# Altium project R100.230.030.000-00 ControlVR.PrjPcb (part 2 of 2)

## Sheet 08_Parallel_operation.SchDoc
size A4; Organization: OLTEST; Revision: 01; SheetNumber: 8; SheetTotal: 13; Название листа: Название листа; Разработчик: Бондарчук С.; Прибор: R100; АМАК.000000.000 Э3: R100.230.030.000-00; Дата: 16.04.2019; Формат: A4; workspacename: R100_Boards_v1; PageSetup: Record=PageOptions|CenterHorizontal=True|CenterVertical=True|PrintScale=0.97|XCorrection=1.00|YCorrection=1.00|PrintKind=0|BorderSize=5000000|LeftOffset=0|BottomOffset=0|Orientation=2|PaperLength=1000|PaperWidth=1000|Scale=100|PaperSource=7|PrintQuality=-3|MediaType=1|DitherType=10|PrintScaleMode=1|PaperKind=A4|PaperIndex=9
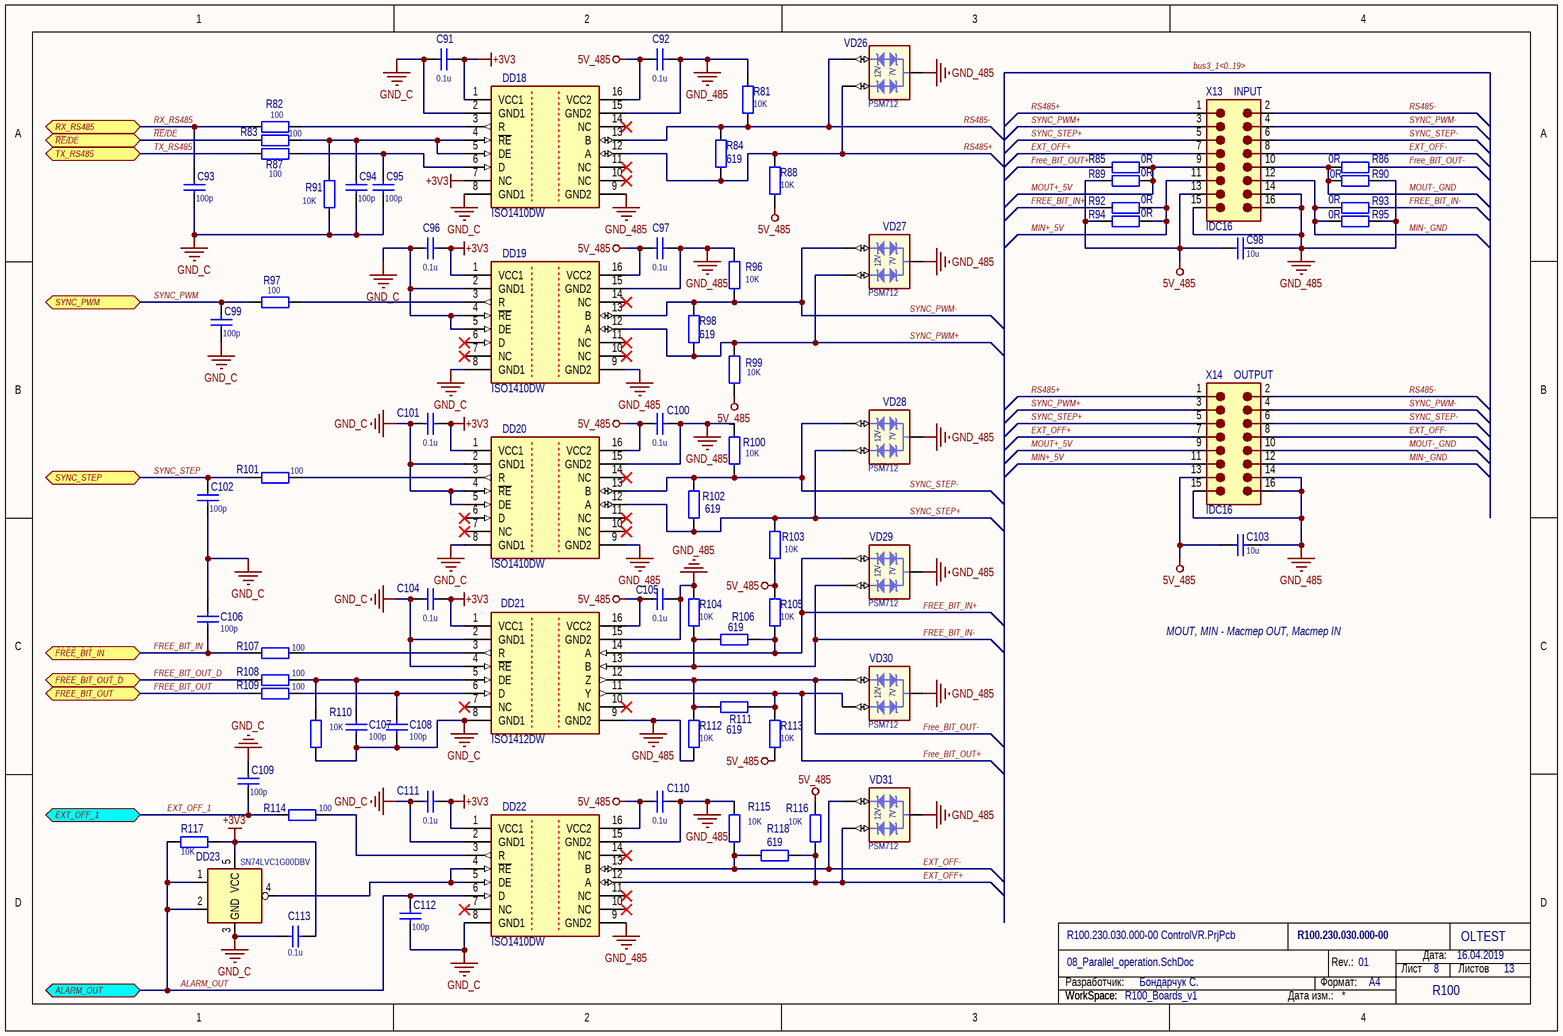
[diagram p7: 08_Parallel_operation.SchDoc]

### Parts
C91  0.1u  [SMD_C_0603]
C92  0.1u  [SMD_C_0603]
C93  100p  [SMD_C_0603]
C94  100p  [SMD_C_0603]
C95  100p  [SMD_C_0603]
C96  0.1u  [SMD_C_0603]
C97  0.1u  [SMD_C_0603]
C98  10u  [SMD_C_1206]
C99  100p  [SMD_C_0603]
C100  0.1u  [SMD_C_0603]
C101  0.1u  [SMD_C_0603]
C102  100p  [SMD_C_0603]
C103  10u  [SMD_C_1206]
C104  0.1u  [SMD_C_0603]
C105  0.1u  [SMD_C_0603]
C106  100p  [SMD_C_0603]
C107  100p  [SMD_C_0603]
C108  100p  [SMD_C_0603]
C109  100p  [SMD_C_0603]
C110  0.1u  [SMD_C_0603]
C111  0.1u  [SMD_C_0603]
C112  100p  [SMD_C_0603]
C113  0.1u  [SMD_C_0603]
DD18  ISO1410DW  [SOIC127P1030X265-16M]
DD19  ISO1410DW  [SOIC127P1030X265-16M]
DD20  ISO1410DW  [SOIC127P1030X265-16M]
DD21  ISO1412DW  [SOIC127P1030X265-16M]
DD22  ISO1410DW  [SOIC127P1030X265-16M]
DD23  SN74LVC1G00DBV  [SOT-23(DBV)]
R81  10K  [SMD_R_0603]
R82  100  [SMD_R_0603]
R83  100  [SMD_R_0603]
R84  619  [SMD_R_0603]
R85  0R  [SMD_R_0603]
R86  0R  [SMD_R_0603]
R87  100  [SMD_R_0603]
R88  10K  [SMD_R_0603]
R89  0R  [SMD_R_0603]
R90  0R  [SMD_R_0603]
R91  10K  [SMD_R_0603]
R92  0R  [SMD_R_0603]
R93  0R  [SMD_R_0603]
R94  0R  [SMD_R_0603]
R95  0R  [SMD_R_0603]
R96  10K  [SMD_R_0603]
R97  100  [SMD_R_0603]
R98  619  [SMD_R_0603]
R99  10K  [SMD_R_0603]
R100  10K  [SMD_R_0603]
R101  100  [SMD_R_0603]
R102  619  [SMD_R_0603]
R103  10K  [SMD_R_0603]
R104  10K  [SMD_R_0603]
R105  10K  [SMD_R_0603]
R106  619  [SMD_R_0603]
R107  100  [SMD_R_0603]
R108  100  [SMD_R_0603]
R109  100  [SMD_R_0603]
R110  10K  [SMD_R_0603]
R111  619  [SMD_R_0603]
R112  10K  [SMD_R_0603]
R113  10K  [SMD_R_0603]
R114  100  [SMD_R_0603]
R115  10K  [SMD_R_0603]
R116  10K  [SMD_R_0603]
R117  10K  [SMD_R_0603]
R118  619  [SMD_R_0603]
VD26  PSM712  [SOT23-3]
VD27  PSM712  [SOT23-3]
VD28  PSM712  [SOT23-3]
VD29  PSM712  [SOT23-3]
VD30  PSM712  [SOT23-3]
VD31  PSM712  [SOT23-3]
X13  IDC16  [918516x324]
X14  IDC16  [918516x324]

### Ports
ALARM_OUT (bidir), EXT_OFF_1 (bidir), FREE_BIT_IN (bidir), FREE_BIT_OUT (bidir), FREE_BIT_OUT_D (bidir), RX_RS485, SYNC_PWM (bidir), SYNC_STEP (bidir), TX_RS485 (bidir), ~{RE}/DE (bidir)

### Nets
5V_485: C92.2 C97.2 C98.2 C100.2 C103.2 C105.2 C110.2 DD18.16(VCC2) DD19.16(VCC2) DD20.16(VCC2) DD21.16(VCC2) DD22.16(VCC2) R88.1 R89.1 R94.1 R99.1 R103.1 R105.2 R113.1 R116.2 X13.13 X14.13
+3V3: C91.1 C96.2 C101.2 C104.2 C111.2 C113.1 DD18.1(VCC1) DD18.7(NC) DD19.1(VCC1) DD20.1(VCC1) DD21.1(VCC1) DD22.1(VCC1) DD23.5(VCC) R117.1
GND_485: C92.1 C97.1 C98.1 C100.1 C103.1 C105.1 C110.1 DD18.9(GND2) DD18.15(GND2) DD19.9(GND2) DD19.15(GND2) DD20.9(GND2) DD20.15(GND2) DD21.9(GND2) DD21.15(GND2) DD22.9(GND2) DD22.15(GND2) R81.1 R90.2 R95.2 R96.2 R100.2 R104.2 R112.1 R115.2 VD26.3(GND) VD27.3(GND) VD28.3(GND) VD29.3(GND) VD30.3(GND) VD31.3(GND) X13.14 X13.15 X13.16 X14.14 X14.15 X14.16
GND_C: C91.2 C93.1 C94.1 C95.1 C96.1 C99.1 C101.1 C102.1 C104.1 C106.1 C107.2 C108.2 C109.2 C111.1 C112.1 C113.2 DD18.2(GND1) DD18.8(GND1) DD19.2(GND1) DD19.4(~{RE}) DD19.5(DE) DD19.8(GND1) DD20.2(GND1) DD20.4(~{RE}) DD20.5(DE) DD20.8(GND1) DD21.2(GND1) DD21.4(~{RE}) DD21.8(GND1) DD22.2(GND1) DD22.8(GND1) DD23.3(GND) R91.1 R110.1
~{RE}/DE: R83.1 ; port ~{RE}/DE
ALARM_OUT: C112.2 DD22.6(D) DD23.1 DD23.2 R117.2 ; port ALARM_OUT
EXT_OFF+: DD22.12(A) R116.1 R118.1 VD31.2(I/O2) X13.7 X14.7
EXT_OFF-: DD22.13(B) R115.1 R118.2 VD31.1(I/O1) X13.8 X14.8
EXT_OFF_1: C109.1 R114.1 ; port EXT_OFF_1
FREE_BIT_IN: C106.2 R107.1 ; port FREE_BIT_IN
FREE_BIT_IN+: DD21.14(A) R92.1 R105.1 R106.1 VD29.1(I/O1)
FREE_BIT_IN-: DD21.13(B) R93.2 R104.1 R106.2 VD29.2(I/O2)
FREE_BIT_OUT: R109.1 ; port FREE_BIT_OUT
Free_BIT_OUT+: DD21.11(Y) R85.1 R111.1 R113.2 VD30.2(I/O2)
Free_BIT_OUT-: DD21.12(Z) R86.2 R111.2 R112.2 VD30.1(I/O1)
FREE_BIT_OUT_D: R108.1 ; port FREE_BIT_OUT_D
MIN+_5V: R92.2 R94.2 X13.11 X14.11
MIN-_GND: R93.1 R95.1 X13.12 X14.12
MOUT+_5V: R85.2 R89.2 X13.9 X14.9
MOUT-_GND: R86.1 R90.1 X13.10 X14.10
RS485+: DD18.12(A) R84.1 R88.2 VD26.2(I/O2) X13.1 X14.1
RS485-: DD18.13(B) R81.2 R84.2 VD26.1(I/O1) X13.2 X14.2
RX_RS485: C93.2 R82.1 ; port RX_RS485
SYNC_PWM: C99.2 R97.1 ; port SYNC_PWM
SYNC_PWM+: DD19.12(A) R98.1 R99.2 VD27.2(I/O2) X13.3 X14.3
SYNC_PWM-: DD19.13(B) R96.1 R98.2 VD27.1(I/O1) X13.4 X14.4
SYNC_STEP: C102.2 R101.1 ; port SYNC_STEP
SYNC_STEP+: DD20.12(A) R102.1 R103.2 VD28.2(I/O2) X13.5 X14.5
SYNC_STEP-: DD20.13(B) R100.1 R102.2 VD28.1(I/O1) X13.6 X14.6
TX_RS485: R87.1 ; port TX_RS485
NetC94_2: C94.2 DD18.4(~{RE}) DD18.5(DE) R83.2 R91.2
NetC95_2: C95.2 DD18.6(D) R87.2
NetC107_1: C107.1 DD21.5(DE) R108.2 R110.2
NetC108_1: C108.1 DD21.6(D) R109.2
NetDD18_3: DD18.3(R) R82.2
NetDD19_3: DD19.3(R) R97.2
NetDD20_3: DD20.3(R) R101.2
NetDD21_3: DD21.3(R) R107.2
NetDD22_3: DD22.3(R) R114.2
NetDD22_4: DD22.4(~{RE}) DD22.5(DE) DD23.4

Not connected (* = marked no-connect by the designer): DD18 10(NC)* 11(NC)* 14(NC)*; DD19 6(D)* 7(NC)* 10(NC)* 11(NC)* 14(NC)*; DD20 6(D)* 7(NC)* 10(NC)* 11(NC)* 14(NC)*; DD21 7(NC)* 10(NC)*; DD22 7(NC)* 10(NC)* 11(NC)* 14(NC)*

### Buses and harness runs
bus bus3_1<0..19>

### Notes on the sheet
- (near X13) INPUT
- (near X14) OUTPUT
- MOUT, MIN - Мастер OUT, Мастер IN
- Разработчик:
- Формат:
- Rev.:
- Лист
- Дата:
- Листов
- WorkSpace:
- Дата изм.:
- (in symbol PSM712) 12V; 7V
- (in symbol SN74LVC1G00DBV) &

### Library data of the parts
C91 C92 C96 C97 C100 C101 C104 C105 C110 C111 C113 = C0603 0.1u 50V 10%: as C4 on sheet 02_MCU; Manufacturer: MURATA; Value: 0.1u
C93-C95 C99 C102 C106-C109 C112 = C0603 100p 100V 5%: as C36 on sheet 04_Debugging; Manufacturer: MURATA; Value: 100p
C98 C103 = C1206 10u 25V 20%: SMD C 1206 MURATA 25V 20% X5R; PartNumber: GRM31MR61E106M; Manufacturer: MURATA; Value: 10u
DD18-DD20 DD22 = ISO1410DW: Isolated, Half-Dupl RS-485 Transiver; Manufacturer: Texas Instrument; Inputs/Outputs: true; PartNumber: ISO1410DW
DD21 = ISO1412DW: Isolated, Full-Dupl RS-485 Transiver; Manufacturer: Texas Instrument; Inputs/Outputs: true; PartNumber: ISO1412DW
DD23 = SN74LVC1G00DBV: as DD2 on sheet 04_Debugging; PartNumber: SN74LVC1G00DBV
R81 R88 R91 R96 R99 R100 R103-R105 R110 R112 R113 R115-R117 = R0603 10К 1%: as R5 on sheet 03_PowerSupply; Manufacturer: VISHAY; Value: 10K
R82 R83 R87 R97 R101 R107-R109 R114 = R0603 100 1%: as R9 on sheet 03_PowerSupply; Manufacturer: VISHAY; Value: 100
R84 R98 R102 R106 R111 R118 = R0603 619 1%: SMD 0603 VISHAY 0.1W 75V 1% 100ppm; PartNumber: CRCW0603619RFK; Manufacturer: VISHAY; Value: 619
R85 R86 R89 R90 R92-R95 = R0603 0R 1%: SMD R 0603 VISHAY 0.1W 75V 1% 100ppm; PartNumber: CRCW06030000Z0; Manufacturer: VISHAY; Value: 0R
VD26-VD31 = PSM712: ASYMMETRICAL DATA LINE PROTECTOR; Manufacturer: Protec Devices; PartNumber: PSM712
X13 X14 = IDC16 324 Harting: Flat Cable Connector (IDC), Low-Profile Male Header, Straight Solder Pin, 16 Contacts, Performance Level 2; PartNumber: 09 18 516 6324; Manufacturer: HARTING

## Sheet 09_MeasInUI.SchDoc
size A4; Organization: OLTEST; Revision: 01; SheetNumber: 9; SheetTotal: 13; Название листа: Название листа; Разработчик: Бондарчук С.; Прибор: R100; АМАК.000000.000 Э3: R100.230.030.000-00; Дата: 16.04.2019; Формат: A4; Workspacename: R100_Boards_v1
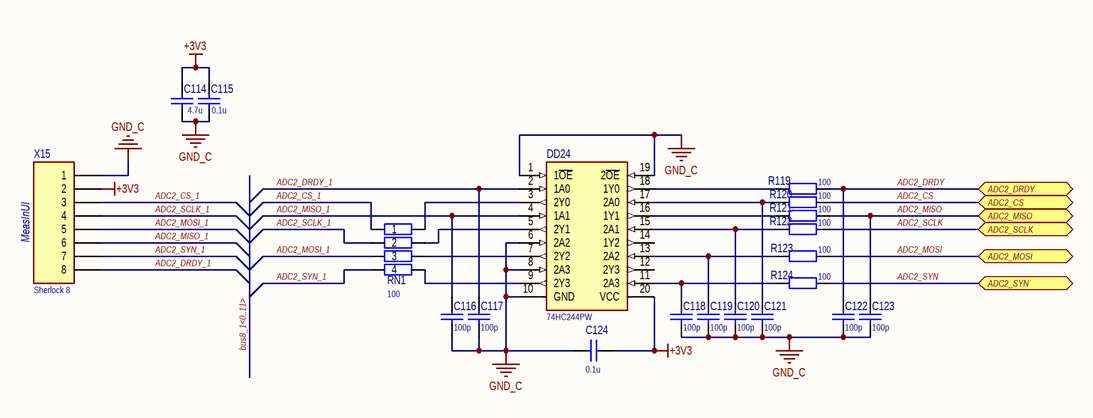
[diagram p8: 09_MeasInUI.SchDoc]

### Parts
C114  4.7u  [SMD_C_0805]
C115  0.1u  [SMD_C_0603]
C116  100p  [SMD_C_0603]
C117  100p  [SMD_C_0603]
C118  100p  [SMD_C_0603]
C119  100p  [SMD_C_0603]
C120  100p  [SMD_C_0603]
C121  100p  [SMD_C_0603]
C122  100p  [SMD_C_0603]
C123  100p  [SMD_C_0603]
C124  0.1u  [SMD_C_0603]
DD24  74HC244PW  [TSSOP20]
R119  100  [SMD_R_0603]
R120  100  [SMD_R_0603]
R121  100  [SMD_R_0603]
R122  100  [SMD_R_0603]
R123  100  [SMD_R_0603]
R124  100  [SMD_R_0603]
RN1  100  [CRA06S]
X15  Sherlock 8  [35362-0850]

### Ports
ADC2_CS, ADC2_DRDY, ADC2_MISO, ADC2_MOSI, ADC2_SCLK, ADC2_SYN

### Nets
+3V3: C114.2 C115.2 C124.2 DD24.20(VCC) X15.2
GND_C: C114.1 C115.1 C116.2 C117.2 C118.2 C119.2 C120.2 C121.2 C122.2 C123.2 C124.1 DD24.1(1~{OE}) DD24.6(2A2) DD24.8(2A3) DD24.10(GND) DD24.19(2~{OE}) X15.1
ADC2_CS: R120.2 ; port ADC2_CS
ADC2_CS_1: RN1.1 X15.3
ADC2_DRDY: C122.1 R119.2 ; port ADC2_DRDY
ADC2_DRDY_1: C117.1 DD24.2(1A0) X15.8
ADC2_MISO: C123.1 R121.2 ; port ADC2_MISO
ADC2_MISO_1: C116.1 DD24.4(1A1) X15.6
ADC2_MOSI: R123.2 ; port ADC2_MOSI
ADC2_MOSI_1: RN1.3 X15.5
ADC2_SCLK: R122.2 ; port ADC2_SCLK
ADC2_SCLK_1: RN1.2 X15.4
ADC2_SYN: R124.2 ; port ADC2_SYN
ADC2_SYN_1: RN1.4 X15.7
NetC118_1: C118.1 DD24.11(2A3) R124.1
NetC119_1: C119.1 DD24.13(2A2) R123.1
NetC120_1: C120.1 DD24.15(2A1) R122.1
NetC121_1: C121.1 DD24.17(2A0) R120.1
NetDD24_3: DD24.3(2Y0) RN1.8
NetDD24_5: DD24.5(2Y1) RN1.7
NetDD24_7: DD24.7(2Y2) RN1.6
NetDD24_9: DD24.9(2Y3) RN1.5
NetDD24_16: DD24.16(1Y1) R121.1
NetDD24_18: DD24.18(1Y0) R119.1

Not connected (* = marked no-connect by the designer): DD24 12(2Y3) 14(1Y2)

### Buses and harness runs
bus bus8_1<0..11>

### Notes on the sheet
- (near X15) MeasInUI
- Разработчик:
- Формат:
- Rev.:
- Лист
- Дата:
- Листов
- WorkSpace:
- Дата изм.:

### Library data of the parts
C114 = C0805 4.7u 25V 20%  X5R: as C3 on sheet 02_MCU; Manufacturer: MURATA; Value: 4.7u
C115 C124 = C0603 0.1u 50V 10%: as C4 on sheet 02_MCU; Manufacturer: MURATA; Value: 0.1u
C116-C123 = C0603 100p 100V 5%: as C36 on sheet 04_Debugging; Manufacturer: MURATA; Value: 100p
DD24 = 74HC244PW: Octal Buffer/Line Driver with 3-State Outputs, PW0020A; Manufacturer: NXP; PartNumber: 74HC244PW
R119-R124 = R0603 100 1%: as R9 on sheet 03_PowerSupply; Manufacturer: VISHAY; Value: 100
RN1 = CRA06S 4x100 1%: SMD RESISTOR ARRAY VISHAY 0.063W 50V 1% 100ppm; PartNumber: CRA06S083100RF; Manufacturer: VISHAY; Value: 100
X15 = 35362-0850: Sherlock 8 Side, 2A 125V 2mm; Manufacturer: MOLEX; PartNumber: 35362-0850

## Sheet 10_MeasOutUI.SchDoc
size A4; Organization: OLTEST; Revision: 01; SheetNumber: 10; SheetTotal: 13; Название листа: Название листа; Разработчик: Бондарчук С.; Прибор: R100; АМАК.000000.000 Э3: R100.230.030.000-00; Дата: 16.04.2019; Формат: A4; workspacename: R100_Boards_v1
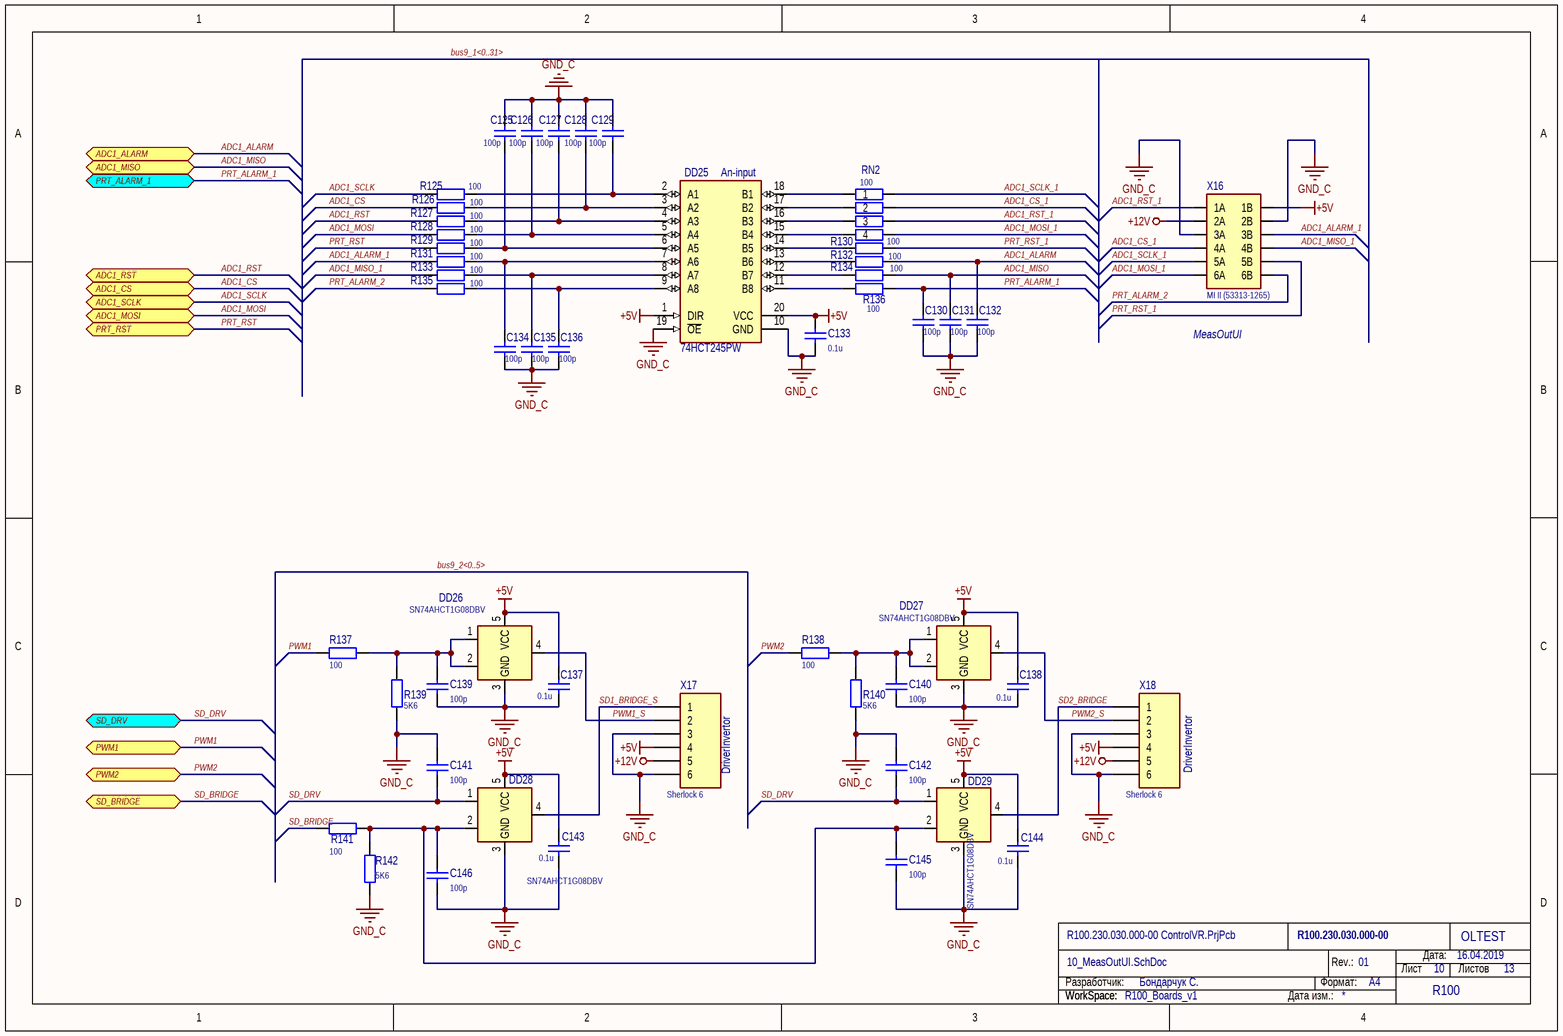
[diagram p9: 10_MeasOutUI.SchDoc]

### Parts
C125  100p  [SMD_C_0603]
C126  100p  [SMD_C_0603]
C127  100p  [SMD_C_0603]
C128  100p  [SMD_C_0603]
C129  100p  [SMD_C_0603]
C130  100p  [SMD_C_0603]
C131  100p  [SMD_C_0603]
C132  100p  [SMD_C_0603]
C133  0.1u  [SMD_C_0603]
C134  100p  [SMD_C_0603]
C135  100p  [SMD_C_0603]
C136  100p  [SMD_C_0603]
C137  0.1u  [SMD_C_0603]
C138  0.1u  [SMD_C_0603]
C139  100p  [SMD_C_0603]
C140  100p  [SMD_C_0603]
C141  100p  [SMD_C_0603]
C142  100p  [SMD_C_0603]
C143  0.1u  [SMD_C_0603]
C144  0.1u  [SMD_C_0603]
C145  100p  [SMD_C_0603]
C146  100p  [SMD_C_0603]
DD25  74HCT245PW  [TSSOP20]
DD26  SN74AHCT1G08DBV  [SOT-23(DBV)]
DD27  SN74AHCT1G08DBV  [SOT-23(DBV)]
DD28  SN74AHCT1G08DBV  [SOT-23(DBV)]
DD29  SN74AHCT1G08DBV  [SOT-23(DBV)]
R125  100  [SMD_R_0603]
R126  100  [SMD_R_0603]
R127  100  [SMD_R_0603]
R128  100  [SMD_R_0603]
R129  100  [SMD_R_0603]
R130  100  [SMD_R_0603]
R131  100  [SMD_R_0603]
R132  100  [SMD_R_0603]
R133  100  [SMD_R_0603]
R134  100  [SMD_R_0603]
R135  100  [SMD_R_0603]
R136  100  [SMD_R_0603]
R137  100  [SMD_R_0603]
R138  100  [SMD_R_0603]
R139  5K6  [SMD_R_0603]
R140  5K6  [SMD_R_0603]
R141  100  [SMD_R_0603]
R142  5K6  [SMD_R_0603]
RN2  100  [CRA06S]
X16  MI II (53313-1265)  [53313-1265]
X17  Sherlock 6  [35362-0650]
X18  Sherlock 6  [35362-0650]

### Ports
ADC1_ALARM, ADC1_CS, ADC1_MISO, ADC1_MOSI, ADC1_RST, ADC1_SCLK, PRT_ALARM_1, PRT_RST, PWM1, PWM2, SD_BRIDGE, SD_DRV (bidir)

### Nets
+5V: C133.2 C137.2 C138.2 C143.2 C144.2 DD25.1(DIR) DD25.20(VCC) DD26.5(VCC) DD27.5(VCC) DD28.5(VCC) DD29.5(VCC) X16.1B X17.4 X18.4
+12V: X16.2A X17.5 X18.5
GND_C: C125.1 C126.1 C127.1 C128.1 C129.1 C130.1 C131.1 C132.1 C133.1 C134.1 C135.1 C136.1 C137.1 C138.1 C139.1 C140.1 C141.2 C142.2 C143.1 C144.1 C145.1 C146.1 DD25.10(GND) DD25.19(~{OE}) DD26.3(GND) DD27.3(GND) DD28.3(GND) DD29.3(GND) R139.1 R140.1 R142.1 X16.2B X16.3A X17.3 X17.6 X18.3 X18.6
ADC1_ALARM: C132.2 R132.2 ; port ADC1_ALARM
ADC1_ALARM_1: R131.1 X16.3B
ADC1_CS: R126.1 ; port ADC1_CS
ADC1_CS_1: RN2.7 X16.4A
ADC1_MISO: C131.2 R134.2 ; port ADC1_MISO
ADC1_MISO_1: R133.1 X16.4B
ADC1_MOSI: R128.1 ; port ADC1_MOSI
ADC1_MOSI_1: RN2.5 X16.6A
ADC1_RST: R127.1 ; port ADC1_RST
ADC1_RST_1: RN2.6 X16.1A
ADC1_SCLK: R125.1 ; port ADC1_SCLK
ADC1_SCLK_1: RN2.8 X16.5A
PRT_ALARM_1: C130.2 R136.2 ; port PRT_ALARM_1
PRT_ALARM_2: R135.1 X16.6B
PRT_RST: R129.1 ; port PRT_RST
PRT_RST_1: R130.2 X16.5B
PWM1: R137.1 ; port PWM1
PWM1_S: DD26.4 X17.2
PWM2: R138.1 ; port PWM2
PWM2_S: DD27.4 X18.2
SD1_BRIDGE_S: DD28.4 X17.1
SD2_BRIDGE: DD29.4 X18.1
SD_BRIDGE: R141.1 ; port SD_BRIDGE
SD_DRV: C141.1 C142.1 DD28.1 DD29.1 ; port SD_DRV
NetC125_2: C125.2 DD25.6(A5) R129.2
NetC126_2: C126.2 DD25.5(A4) R128.2
NetC127_2: C127.2 DD25.4(A3) R127.2
NetC128_2: C128.2 DD25.3(A2) R126.2
NetC129_2: C129.2 DD25.2(A1) R125.2
NetC134_2: C134.2 DD25.7(A6) R131.2
NetC135_2: C135.2 DD25.8(A7) R133.2
NetC136_2: C136.2 DD25.9(A8) R135.2
NetC139_2: C139.2 DD26.1 DD26.2 R137.2 R139.2
NetC140_2: C140.2 DD27.1 DD27.2 R138.2 R140.2
NetC145_2: C145.2 C146.2 DD28.2 DD29.2 R141.2 R142.2
NetDD25_11: DD25.11(B8) R136.1
NetDD25_12: DD25.12(B7) R134.1
NetDD25_13: DD25.13(B6) R132.1
NetDD25_14: DD25.14(B5) R130.1
NetDD25_15: DD25.15(B4) RN2.4
NetDD25_16: DD25.16(B3) RN2.3
NetDD25_17: DD25.17(B2) RN2.2
NetDD25_18: DD25.18(B1) RN2.1

### Buses and harness runs
bus bus9_1<0..31>
bus bus9_2<0..5>

### Notes on the sheet
- (near DD25) An-input
- MeasOutUI
- (near X17) DriverInvertor
- (near X18) DriverInvertor
- Разработчик:
- Формат:
- Rev.:
- Лист
- Дата:
- Листов
- WorkSpace:
- Дата изм.:
- (in symbol SN74AHCT1G08DBV) &

### Library data of the parts
C125-C132 C134-C136 C139-C142 C145 C146 = C0603 100p 100V 5%: SMD C 0603 MURATA 100V 5% NP0; PartNumber: GRM1885C2A101JA01; Manufacturer: MURATA; Value: 100p
C133 C137 C138 C143 C144 = C0603 0.1u 50V 10%: SMD C 0603 MURATA 50V 10% X7R; PartNumber: GRM188R71H104K; Manufacturer: MURATA; Value: 0.1u
DD25 = 74HCT245PW: Octal Bus Transceivers With 3-State Outputs, PW0020A; Manufacturer: NXP; PartNumber: 74HCT245PW
DD26-DD29 = SN74AHCT1G08DBV: 2-in AND; Manufacturer: Texas Instruments; PartNumber: SN74AHCT1G08DBV
R125-R138 R141 = R0603 100 1%: SMD R 0603 VISHAY 0.1W 75V 1% 100ppm; PartNumber: CRCW0603100RFK; Manufacturer: VISHAY; Value: 100
R139 R140 R142 = R0603 5K6 1%: SMD R 0603 VISHAY 0.1W 75V 1% 100ppm; PartNumber: CRCW06035K60FK; Manufacturer: VISHAY; Value: 5K6
RN2 = CRA06S 4x100 1%: SMD RESISTOR ARRAY VISHAY 0.063W 50V 1% 100ppm; PartNumber: CRA06S083100RF; Manufacturer: VISHAY; Value: 100
X16 = 53313-1265: MI II 12 (6x2row), 2A 125V 2mm; Manufacturer: MOLEX; PartNumber: 53313-1265
X17 X18 = 35363-0650: Sherlock 6 Side, 2A 125V 2mm; Manufacturer: MOLEX; PartNumber: 35362-0650

## Sheet 11_Fun.SchDoc
size A4; Organization: OLTEST; Revision: 01; SheetNumber: 11; SheetTotal: 13; Название листа: Название листа; Разработчик: Бондарчук С.; Прибор: R100; АМАК.000000.000 Э3: R100.230.030.000-00; Дата: 16.04.2019; Формат: A4; workspacename: R100_Boards_v1
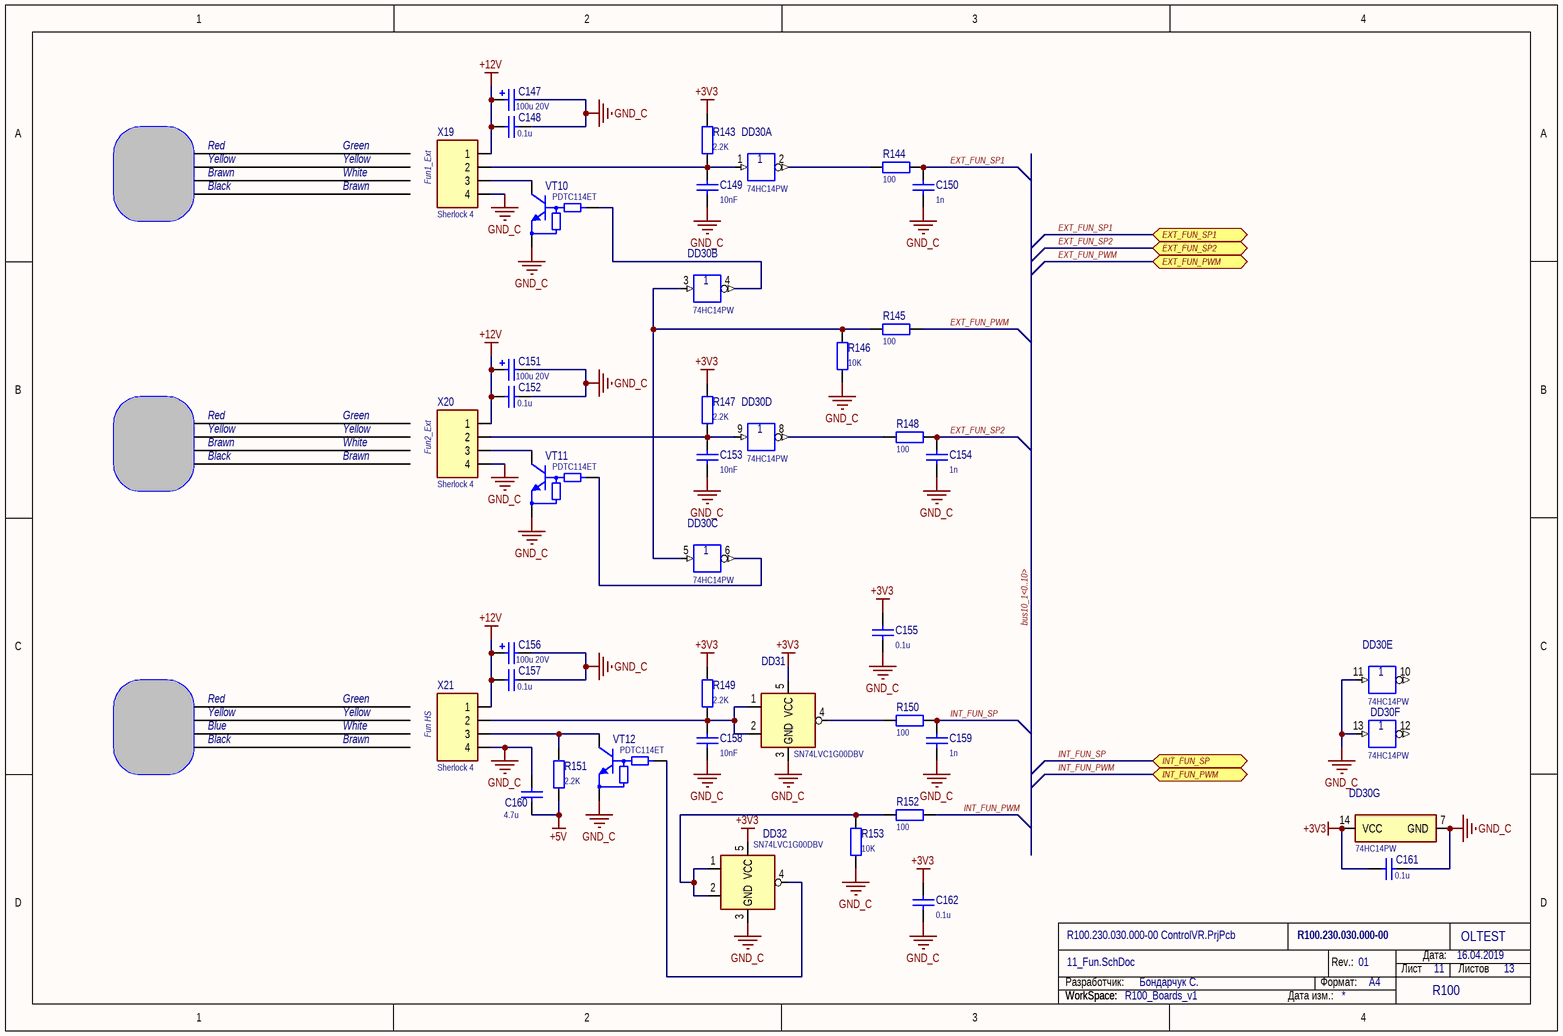
[diagram p10: 11_Fun.SchDoc]

### Parts
C147  100u 20V  [TAJD]
C148  0.1u  [SMD_C_0603]
C149  10nF  [SMD_C_0603]
C150  1n  [SMD_C_0603]
C151  100u 20V  [TAJD]
C152  0.1u  [SMD_C_0603]
C153  10nF  [SMD_C_0603]
C154  1n  [SMD_C_0603]
C155  0.1u  [SMD_C_0603]
C156  100u 20V  [TAJD]
C157  0.1u  [SMD_C_0603]
C158  10nF  [SMD_C_0603]
C159  1n  [SMD_C_0603]
C160  4.7u  [SMD_C_0805]
C161  0.1u  [SMD_C_0603]
C162  0.1u  [SMD_C_0603]
DD30  74HC14PW  [TSSOP14]  (parts A,B,C,D,E,F,G of 7)
DD31  SN74LVC1G00DBV  [SOT-23(DBV)]
DD32  SN74LVC1G00DBV  [SOT-23(DBV)]
R143  2.2K  [SMD_R_0603]
R144  100  [SMD_R_0603]
R145  100  [SMD_R_0603]
R146  10K  [SMD_R_0603]
R147  2.2K  [SMD_R_0603]
R148  100  [SMD_R_0603]
R149  2.2K  [SMD_R_0603]
R150  100  [SMD_R_0603]
R151  2.2K  [SMD_R_0603]
R152  100  [SMD_R_0603]
R153  10K  [SMD_R_0603]
VT10  PDTC114ET  [SOT23-3]
VT11  PDTC114ET  [SOT23-3]
VT12  PDTC114ET  [SOT23-3]
X19  Sherlock 4  [35362-0450]
X20  Sherlock 4  [35362-0450]
X21  Sherlock 4  [35362-0450]

### Ports
EXT_FUN_PWM, EXT_FUN_SP1, EXT_FUN_SP2, INT_FUN_PWM, INT_FUN_SP

### Nets
+3V3: C155.2 C161.1 C162.2 DD30.14(VCC) DD31.5(VCC) DD32.5(VCC) R143.2 R147.2 R149.2
+5V: C160.1 R151.1
+12V: C147.1 C148.1 C151.1 C152.1 C156.1 C157.1 X19.1 X20.1 X21.1
GND_C: C147.2 C148.2 C149.2 C150.1 C151.2 C152.2 C153.2 C154.1 C155.1 C156.2 C157.2 C158.2 C159.1 C160.2 C161.2 C162.1 DD30.7(GND) DD30.11(5A) DD30.13(6A) DD31.3(GND) DD32.3(GND) R146.1 R153.1 VT10.2(E) VT11.2(E) VT12.2(E) X19.4 X20.4 X21.4
EXT_FUN_PWM: R145.2 ; port EXT_FUN_PWM
EXT_FUN_SP1: C150.2 R144.2 ; port EXT_FUN_SP1
EXT_FUN_SP2: C154.2 R148.2 ; port EXT_FUN_SP2
INT_FUN_PWM: R152.2 ; port INT_FUN_PWM
INT_FUN_SP: C159.2 R150.2 ; port INT_FUN_SP
NetC149_1: C149.1 DD30.1(1A) R143.1 X19.2
NetC153_1: C153.1 DD30.9(4A) R147.1 X20.2
NetC158_1: C158.1 DD31.1 DD31.2 R149.1 X21.2
NetDD30_2: DD30.2(1Y) R144.1
NetDD30_3: DD30.3(2A) DD30.5(3A) R145.1 R146.2
NetDD30_4: DD30.4(2Y) VT10.1(B)
NetDD30_6: DD30.6(3Y) VT11.1(B)
NetDD30_8: DD30.8(4Y) R148.1
NetDD31_4: DD31.4 R150.1
NetDD32_1: DD32.1 DD32.2 R152.1 R153.2
NetDD32_4: DD32.4 VT12.1(B)
NetR151_2: R151.2 VT12.3(C) X21.3
NetVT10_3: VT10.3(C) X19.3
NetVT11_3: VT11.3(C) X20.3

Not connected (* = marked no-connect by the designer): DD30 10(5Y) 12(6Y)

### Buses and harness runs
bus bus10_1<0..10>

### Notes on the sheet
- Red
- Yellow
- Brawn
- Green
- White
- (near X19) Fun1_Ext
- Black
- (near X20) Fun2_Ext
- Blue
- (near X21) Fun HS
- Разработчик:
- Формат:
- Rev.:
- Лист
- Дата:
- Листов
- WorkSpace:
- Дата изм.:
- (in symbol SN74LVC1G00DBV) &

### Library data of the parts
C147 C151 C156 = TECAP 100u 20V 10%: SMD SIZE D TANTALUM AVX 20V 10%; PartNumber: TAJD107K020RNJ; Manufacturer: AVX; Value: 100u 20V
C148 C152 C155 C157 C161 C162 = C0603 0.1u 50V 10%: as C133 on sheet 10_MeasOutUI; Manufacturer: MURATA; Value: 0.1u
C149 C153 C158 = C0603 10nF 100V 10%: SMD C 0603 MURATA 100V 10% X7R; PartNumber: GRJ188R72A103KE11#; Manufacturer: MURATA; Value: 10nF
C150 C154 C159 = C0603 1n 50V 5%: SMD C 0603 MURATA 50V 5% NP0; PartNumber: GRM1885C1H102JA01; Manufacturer: MURATA; Value: 1n
C160 = C0805 4.7u 25V 20%  X5R: SMD C 0805 MURATA 50V 5% NP0; PartNumber: GRM21BR61E475M; Manufacturer: MURATA; Value: 4.7u
DD30 = 74HC14: Quadruple 2-Input Positive-OR Gates, PW0014A; Manufacturer: Texas Instruments; PackageReference: PW0014A; PartNumber: 74HC14PW
DD31 DD32 = SN74LVC1G00DBV: 2-in NAND; Manufacturer: Texas Instruments; PartNumber: SN74LVC1G00DBV
R143 R147 R149 R151 = R0603 2.2K 1%: SMD R 0603 VISHAY 0.1W 75V 1% 100ppm; PartNumber: CRCW06032K20FK; Manufacturer: VISHAY; Value: 2.2K
R144 R145 R148 R150 R152 = R0603 100 1%: as R125-R138 on sheet 10_MeasOutUI; Manufacturer: VISHAY; Value: 100
R146 R153 = R0603 10К 1%: SMD R 0603 VISHAY 0.1W 75V 1% 100ppm; PartNumber: CRCW060310K0FK; Manufacturer: VISHAY; Value: 10K
VT10-VT12 = PDTC114ET: Digital Transistor (BRT), R1=10 kOhm, R2=10 kOhm, NPN Transistor; Manufacturer: On Semiconductor; PartNumber: PDTC114ET
X19-X21 = 35362-0450: Sherlock 4 Top, 2A 125V 2mm; Manufacturer: MOLEX; PartNumber: 35362-0450

## Sheet 12_TempSensors.SchDoc
size A4; Organization: OLTEST; Revision: 01; SheetNumber: 12; SheetTotal: 13; Название листа: Название листа; Разработчик: Бондарчук С.; Прибор: R100; АМАК.000000.000 Э3: R100.230.030.000-00; Дата: 16.04.2013; Формат: A4; Workspacename: R100_Boards_v1
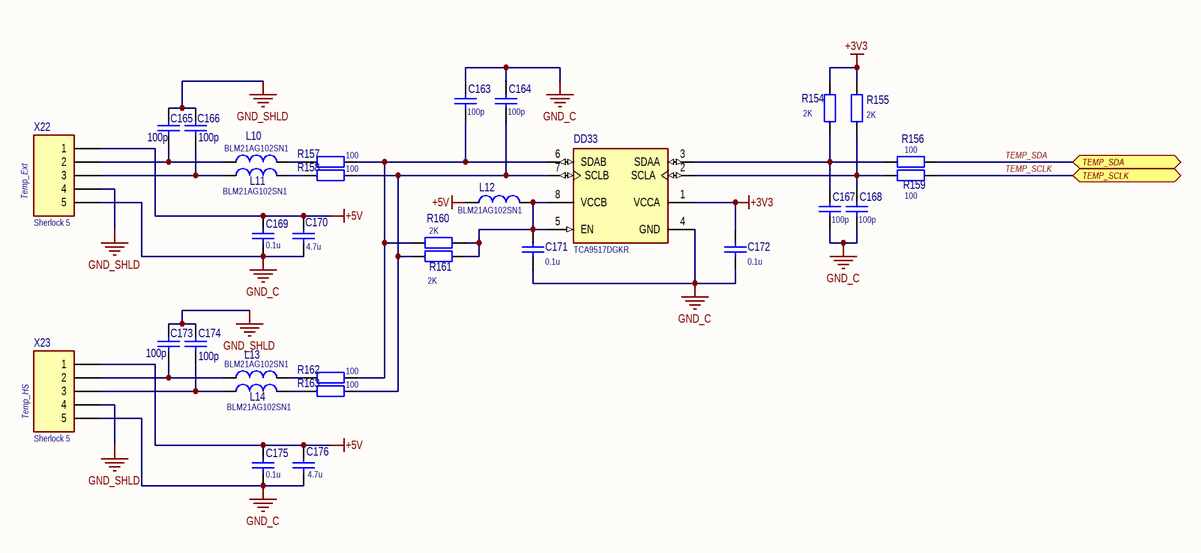
[diagram p11: 12_TempSensors.SchDoc]

### Parts
C163  100p  [SMD_C_0603]
C164  100p  [SMD_C_0603]
C165  100p  [SMD_C_0603]
C166  100p  [SMD_C_0603]
C167  100p  [SMD_C_0603]
C168  100p  [SMD_C_0603]
C169  0.1u  [SMD_C_0603]
C170  4.7u  [SMD_C_0805]
C171  0.1u  [SMD_C_0603]
C172  0.1u  [SMD_C_0603]
C173  100p  [SMD_C_0603]
C174  100p  [SMD_C_0603]
C175  0.1u  [SMD_C_0603]
C176  4.7u  [SMD_C_0805]
DD33  TCA9517DGKR  [DGK8_M]
L10  BLM21AG102SN1  [SMD_L_L2_W1.25]
L11  BLM21AG102SN1  [SMD_L_L2_W1.25]
L12  BLM21AG102SN1  [SMD_L_L2_W1.25]
L13  BLM21AG102SN1  [SMD_L_L2_W1.25]
L14  BLM21AG102SN1  [SMD_L_L2_W1.25]
R154  2K  [SMD_R_0603]
R155  2K  [SMD_R_0603]
R156  100  [SMD_R_0603]
R157  100  [SMD_R_0603]
R158  100  [SMD_R_0603]
R159  100  [SMD_R_0603]
R160  2K  [SMD_R_0603]
R161  2K  [SMD_R_0603]
R162  100  [SMD_R_0603]
R163  100  [SMD_R_0603]
X22  Sherlock 5  [35362-0550]
X23  Sherlock 5  [35362-0550]

### Ports
TEMP_SCLK, TEMP_SDA

### Nets
+3V3: C172.2 DD33.1(VCCA) R154.2 R155.2
+5V: C169.2 C170.2 C175.2 C176.2 L12.1 X22.1 X23.1
GND_C: C163.2 C164.2 C167.1 C168.1 C169.1 C170.1 C171.1 C172.1 C175.1 C176.1 DD33.4(GND) X22.5 X23.5
GND_SHLD: C165.2 C166.2 C173.2 C174.2 X22.4 X23.4
TEMP_SCLK: R159.2 ; port TEMP_SCLK
TEMP_SDA: R156.2 ; port TEMP_SDA
NetC163_1: C163.1 DD33.6(SDAB) R157.2 R160.1 R162.2
NetC164_1: C164.1 DD33.7(SCLB) R158.2 R161.1 R163.2
NetC165_1: C165.1 L10.1 X22.2
NetC166_1: C166.1 L11.1 X22.3
NetC167_2: C167.2 DD33.3(SDAA) R154.1 R156.1
NetC168_2: C168.2 DD33.2(SCLA) R155.1 R159.1
NetC171_2: C171.2 DD33.5(EN) DD33.8(VCCB) L12.2 R160.2 R161.2
NetC173_1: C173.1 L13.1 X23.2
NetC174_1: C174.1 L14.1 X23.3
NetL10_2: L10.2 R157.1
NetL11_2: L11.2 R158.1
NetL13_2: L13.2 R162.1
NetL14_2: L14.2 R163.1

### Notes on the sheet
- (near X22) Temp_Ext
- (near X23) Temp_HS
- Разработчик:
- Формат:
- Rev.:
- Лист
- Дата:
- Листов
- WorkSpace:
- Дата изм.:

### Library data of the parts
C163-C168 C173 C174 = C0603 100p 100V 5%: as C125-C132 on sheet 10_MeasOutUI; Manufacturer: MURATA; Value: 100p
C169 C171 C172 C175 = C0603 0.1u 50V 10%: as C133 on sheet 10_MeasOutUI; Manufacturer: MURATA; Value: 0.1u
C170 C176 = C0805 4.7u 25V 20%  X5R: as C160 on sheet 11_Fun; Manufacturer: MURATA; Value: 4.7u
DD33 = TCA9517DGKR: Level-Shifting I 2C Bus Repeater; Manufacturer: Texas Instruments; PartNumber: TCA9517DGKR
L10-L14 = BLM21AG102SN1: 1000R 0.6A (100MHz); Manufacturer: TDK; Value: 1000R 0.6A (100MHz); PartNumber: BLM21AG102SN1
R154 R155 R160 R161 = R0603 2K 1%: SMD R 0603 VISHAY 0.1W 75V 1% 100ppm; PartNumber: CRCW06032K00FK; Manufacturer: VISHAY; Value: 2K
R156-R159 R162 R163 = R0603 100 1%: as R125-R138 on sheet 10_MeasOutUI; Manufacturer: VISHAY; Value: 100
X22 X23 = 35362-0550: Sherlock 5 Top, 2A 125V 2mm; Manufacturer: MOLEX; PartNumber: 35362-0550

## Sheet 13_AdditionalFunction.SchDoc
size A4; Organization: OLTEST; Revision: 01; SheetNumber: 13; SheetTotal: 13; Название листа: Название листа; Разработчик: Бондарчук С.; Прибор: R100; АМАК.000000.000 Э3: R100.230.030.000-00; Дата: 16.04.2019; Формат: A4; workspacename: R100_Boards_v1
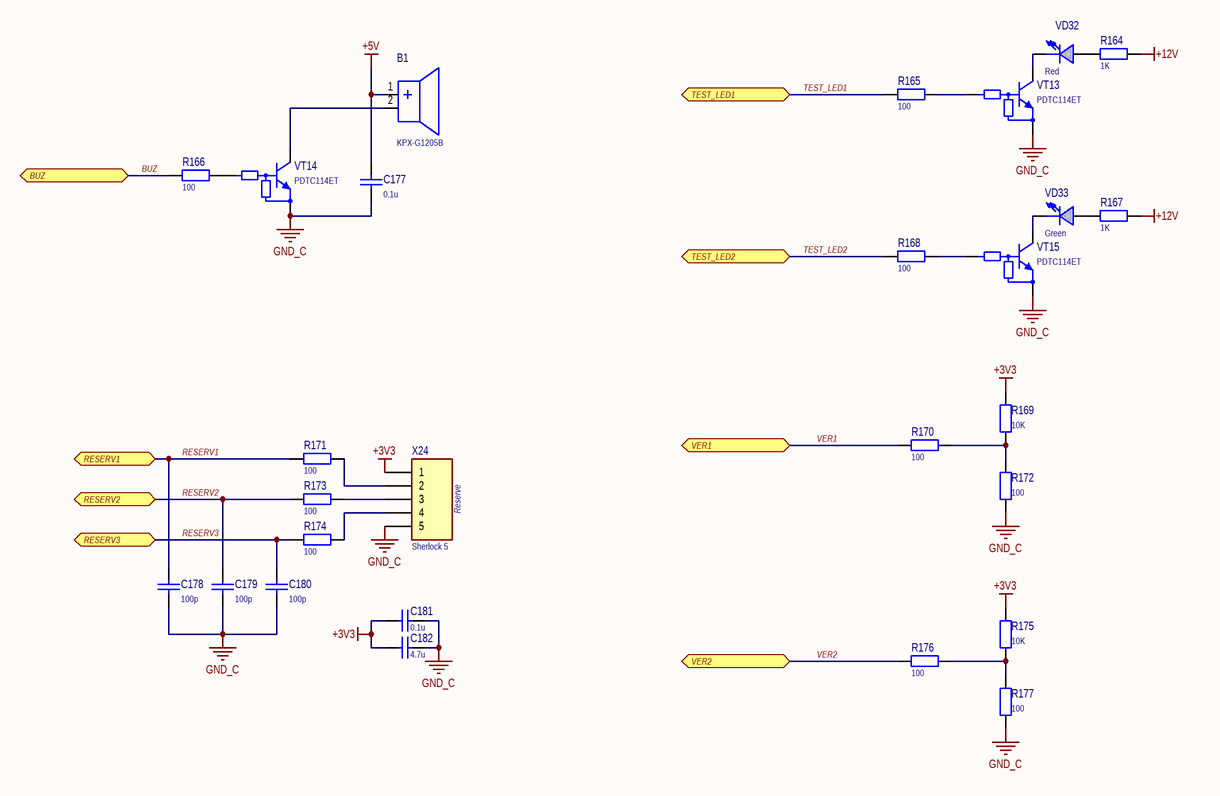
[diagram p12: 13_AdditionalFunction.SchDoc]

### Parts
B1  KPX-G1205B  [KPX-G12]
C177  0.1u  [SMD_C_0603]
C178  100p  [SMD_C_0603]
C179  100p  [SMD_C_0603]
C180  100p  [SMD_C_0603]
C181  0.1u  [SMD_C_0603]
C182  4.7u  [SMD_C_0805]
R164  1K  [SMD_R_1206]
R165  100  [SMD_R_0603]
R166  100  [SMD_R_0603]
R167  1K  [SMD_R_1206]
R168  100  [SMD_R_0603]
R169  10K  [SMD_R_0603]
R170  100  [SMD_R_0603]
R171  100  [SMD_R_0603]
R172  100  [SMD_R_0603]
R173  100  [SMD_R_0603]
R174  100  [SMD_R_0603]
R175  10K  [SMD_R_0603]
R176  100  [SMD_R_0603]
R177  100  [SMD_R_0603]
VD32  value Red  [SMD_LED_LL_Red]  (hidden comment: LL-S172SC-2S)
VD33  value Green  [SMD_LED_LL_Green]  (hidden comment: LL-S172GC-2A)
VT13  PDTC114ET  [SOT23-3]
VT14  PDTC114ET  [SOT23-3]
VT15  PDTC114ET  [SOT23-3]
X24  Sherlock 5  [35362-0550]

### Ports
BUZ, RESERV1, RESERV2, RESERV3, TEST_LED1, TEST_LED2, VER1, VER2

### Nets
+3V3: C181.1 C182.1 R169.2 R175.2 X24.1
+5V: B1.1(+) C177.2
+12V: R164.2 R167.2
GND_C: C177.1 C178.1 C179.1 C180.1 C181.2 C182.2 R172.1 R177.1 VT13.2(E) VT14.2(E) VT15.2(E) X24.5
BUZ: R166.1 ; port BUZ
RESERV1: C178.2 R171.1 ; port RESERV1
RESERV2: C179.2 R173.1 ; port RESERV2
RESERV3: C180.2 R174.1 ; port RESERV3
TEST_LED1: R165.1 ; port TEST_LED1
TEST_LED2: R168.1 ; port TEST_LED2
VER1: R170.1 ; port VER1
VER2: R176.1 ; port VER2
NetB1_2: B1.2(-) VT14.3(C)
NetR164_1: R164.1 VD32.1(ANODE)
NetR165_2: R165.2 VT13.1(B)
NetR166_2: R166.2 VT14.1(B)
NetR167_1: R167.1 VD33.1(ANODE)
NetR168_2: R168.2 VT15.1(B)
NetR169_1: R169.1 R170.2 R172.2
NetR171_2: R171.2 X24.2
NetR173_2: R173.2 X24.3
NetR174_2: R174.2 X24.4
NetR175_1: R175.1 R176.2 R177.2
NetVD32_2: VD32.2(CATHODE) VT13.3(C)
NetVD33_2: VD33.2(CATHODE) VT15.3(C)

### Notes on the sheet
- (near X24) Reserve
- Разработчик:
- Формат:
- Rev.:
- Лист
- Дата:
- Листов
- WorkSpace:
- Дата изм.:

### Library data of the parts
B1 = KPX-G1205B: Magnetic Buzzer; Manufacturer: KEPO; PartNumber: KPX-G1205B
C177 C181 = C0603 0.1u 50V 10%: as C133 on sheet 10_MeasOutUI; Manufacturer: MURATA; Value: 0.1u
C178-C180 = C0603 100p 100V 5%: as C125-C132 on sheet 10_MeasOutUI; Manufacturer: MURATA; Value: 100p
C182 = C0805 4.7u 25V 20%  X5R: as C160 on sheet 11_Fun; Manufacturer: MURATA; Value: 4.7u
R164 R167 = R1206 1K 1%: SMD R 1206 VISHAY 0.25W 200V 1% 100ppm; PartNumber: CRCW12061K00FK; Manufacturer: VISHAY; Value: 1K
R165 R166 R168 R170-R174 R176 R177 = R0603 100 1%: as R125-R138 on sheet 10_MeasOutUI; Manufacturer: VISHAY; Value: 100
R169 R175 = R0603 10К 1%: as R146 on sheet 11_Fun; Manufacturer: VISHAY; Value: 10K
VD32 = LL-S172SC-2S: LED Red SMD; Manufacturer: Lucky Light; PartNumber: LL-S172SC-2S
VD33 = LL-S172GC-2A: LED Green SMD; Manufacturer: Lucky Light; PartNumber: LL-S172GC-2A
VT13-VT15 = PDTC114ET: as VT10-VT12 on sheet 11_Fun; PartNumber: PDTC114ET
X24 = 35362-0550: as X22 on sheet 12_TempSensors; PartNumber: 35362-0550

## Nets that join several sheets
+3V3: 02_MCU (L1.1), 03_PowerSupply (C31.1 DA3.2 DA3.4 VD1.1), 04_Debugging (13 pins), 06_PowerRele_OnOff (19 pins), 07_EEPR_DISCHAR (5 pins), 08_Parallel_operation (14 pins), 09_MeasInUI (5 pins), 11_Fun (9 pins), 12_TempSensors (C172.2 DD33.1 R154.2 R155.2), 13_AdditionalFunction (5 pins)
+5V: 03_PowerSupply (10 pins), 04_Debugging (DD4.1 R13.2 R22.1 R23.1), 05_FOC_RS_Interface (15 pins), 10_MeasOutUI (14 pins), 11_Fun (C160.1 R151.1), 12_TempSensors (7 pins), 13_AdditionalFunction (B1.1 C177.2)
+12V: 03_PowerSupply (5 pins), 06_PowerRele_OnOff (11 pins), 07_EEPR_DISCHAR (C90.2 R80.2), 10_MeasOutUI (X16.2A X17.5 X18.5), 11_Fun (9 pins), 13_AdditionalFunction (R164.2 R167.2)
GND_C: 02_MCU (31 pins), 03_PowerSupply (20 pins), 04_Debugging (28 pins), 05_FOC_RS_Interface (19 pins), 06_PowerRele_OnOff (57 pins), 07_EEPR_DISCHAR (6 pins), 08_Parallel_operation (34 pins), 09_MeasInUI (17 pins), 10_MeasOutUI (37 pins), 11_Fun (29 pins), 12_TempSensors (13 pins), 13_AdditionalFunction (12 pins)
~220V_L: 03_PowerSupply (DA2.1 R4.2 X2.2), 06_PowerRele_OnOff (6 pins)
~220V_N: 03_PowerSupply (DA2.2 R3.2 X2.3), 06_PowerRele_OnOff (F3.1)
~{RE}/DE: 02_MCU (DD1.20), 08_Parallel_operation (R83.1)
ADC1_ALARM: 02_MCU (DD1.114), 10_MeasOutUI (C132.2 R132.2)
ADC1_CS: 02_MCU (DD1.116), 10_MeasOutUI (R126.1)
ADC1_MISO: 02_MCU (DD1.112), 10_MeasOutUI (C131.2 R134.2)
ADC1_MOSI: 02_MCU (DD1.113), 10_MeasOutUI (R128.1)
ADC1_RST: 02_MCU (DD1.115), 10_MeasOutUI (R127.1)
ADC1_SCLK: 02_MCU (DD1.111), 10_MeasOutUI (R125.1)
ADC2_CS: 02_MCU (DD1.127), 09_MeasInUI (R120.2)
ADC2_DRDY: 02_MCU (DD1.125), 09_MeasInUI (C122.1 R119.2)
ADC2_MISO: 02_MCU (DD1.124), 09_MeasInUI (C123.1 R121.2)
ADC2_MOSI: 02_MCU (DD1.123), 09_MeasInUI (R123.2)
ADC2_SCLK: 02_MCU (DD1.126), 09_MeasInUI (R122.2)
ADC2_SYN: 02_MCU (DD1.134), 09_MeasInUI (R124.2)
ALARM_OUT: 06_PowerRele_OnOff (R51.2), 08_Parallel_operation (5 pins)
BOOT: 02_MCU (DD1.138), 04_Debugging (R18.2)
BTN_DISCHARGE: 02_MCU (DD1.63), 07_EEPR_DISCHAR (C89.2 R77.2)
BUZ: 02_MCU (DD1.44), 13_AdditionalFunction (R166.1)
BUZZ_ONOFF: 02_MCU (DD1.2), 06_PowerRele_OnOff (R53.2)
ES_ALARM: 02_MCU (DD1.139), 06_PowerRele_OnOff (C62.2 R45.2)
EXT_FUN_PWM: 02_MCU (DD1.36), 11_Fun (R145.2)
EXT_FUN_SP1: 02_MCU (DD1.98), 11_Fun (C150.2 R144.2)
EXT_FUN_SP2: 02_MCU (DD1.99), 11_Fun (C154.2 R148.2)
EXT_OFF: 02_MCU (DD1.5), 06_PowerRele_OnOff (R48.2)
EXT_OFF_1: 06_PowerRele_OnOff (DD11.10 R48.1), 08_Parallel_operation (C109.1 R114.1)
FREE_BIT_IN: 02_MCU (DD1.92), 08_Parallel_operation (C106.2 R107.1)
FREE_BIT_OUT: 02_MCU (DD1.91), 08_Parallel_operation (R109.1)
FREE_BIT_OUT_D: 02_MCU (DD1.88), 08_Parallel_operation (R108.1)
INT_FUN_PWM: 02_MCU (DD1.37), 11_Fun (R152.2)
INT_FUN_SP: 02_MCU (DD1.96), 11_Fun (C159.2 R150.2)
LED_DISCHARGE: 02_MCU (DD1.64), 07_EEPR_DISCHAR (R79.2)
LS_ALARM: 02_MCU (DD1.132), 06_PowerRele_OnOff (C63.2 R44.2)
NRST: 02_MCU (DD1.25), 04_Debugging (C45.2 R24.1 R25.1)
PRT_ALARM: 02_MCU (DD1.135), 06_PowerRele_OnOff (C64.2 R46.2)
PRT_ALARM_1: 06_PowerRele_OnOff (VT6.1), 10_MeasOutUI (C130.2 R136.2)
PRT_RST: 02_MCU (DD1.117), 10_MeasOutUI (R129.1)
PWM1: 02_MCU (DD1.60), 10_MeasOutUI (R137.1)
PWM2: 02_MCU (DD1.74), 10_MeasOutUI (R138.1)
RESERV1: 02_MCU (DD1.53), 13_AdditionalFunction (C178.2 R171.1)
RESERV2: 02_MCU (DD1.54), 13_AdditionalFunction (C179.2 R173.1)
RESERV3: 02_MCU (DD1.55), 13_AdditionalFunction (C180.2 R174.1)
RST_ALARM: 02_MCU (DD1.140), 06_PowerRele_OnOff (R47.2)
RX_DEB: 02_MCU (DD1.102), 04_Debugging (R12.1 R17.2)
RX_INT: 02_MCU (DD1.119), 05_FOC_RS_Interface (R36.2)
RX_RS485: 02_MCU (DD1.58), 08_Parallel_operation (C93.2 R82.1)
SCL_EEPROM: 02_MCU (DD1.69), 07_EEPR_DISCHAR (R73.2)
SD_BRIDGE: 02_MCU (DD1.29), 10_MeasOutUI (R141.1)
SD_DRV: 06_PowerRele_OnOff (R54.2), 10_MeasOutUI (C141.1 C142.1 DD28.1 DD29.1)
SDA_EEPROM: 02_MCU (DD1.70), 07_EEPR_DISCHAR (R74.2)
SOFT_RES: 02_MCU (DD1.104), 04_Debugging (R28.2)
SW_REL_ONOFF: 02_MCU (DD1.3), 06_PowerRele_OnOff (R50.2)
SWDCLK: 02_MCU (DD1.109), 04_Debugging (R31.2 X4.4)
SWDIO: 02_MCU (DD1.105), 04_Debugging (R30.1 X4.2)
SWO: 02_MCU (DD1.133), 04_Debugging (R29.1 X4.6)
Syn_50Hz: 02_MCU (DD1.75), 03_PowerSupply (C35.2 R9.2)
SYNC_PWM: 02_MCU (DD1.41), 08_Parallel_operation (C99.2 R97.1)
SYNC_STEP: 02_MCU (DD1.90), 08_Parallel_operation (C102.2 R101.1)
TEMP_SCLK: 02_MCU (DD1.136), 12_TempSensors (R159.2)
TEMP_SDA: 02_MCU (DD1.137), 12_TempSensors (R156.2)
TEST_LED1: 02_MCU (DD1.43), 13_AdditionalFunction (R165.1)
TEST_LED2: 02_MCU (DD1.42), 13_AdditionalFunction (R168.1)
TX_DEB: 02_MCU (DD1.101), 04_Debugging (R14.1 R21.2)
TX_INT: 02_MCU (DD1.122), 05_FOC_RS_Interface (R38.2)
TX_RS485: 02_MCU (DD1.59), 08_Parallel_operation (R87.1)
VER1: 02_MCU (DD1.45), 13_AdditionalFunction (R170.1)
VER2: 02_MCU (DD1.46), 13_AdditionalFunction (R176.1)
WP_EEPROM: 02_MCU (DD1.73), 07_EEPR_DISCHAR (R75.2)